# Altium schematic sheet power.SchDoc: Power
size A; Engineer: A. Peck; Organization: UCLA High Energy Physics; DocumentNumber: 14; Revision: 3.0; SheetNumber: 14; SheetTotal: 15; Project: LCT Comparator Tester
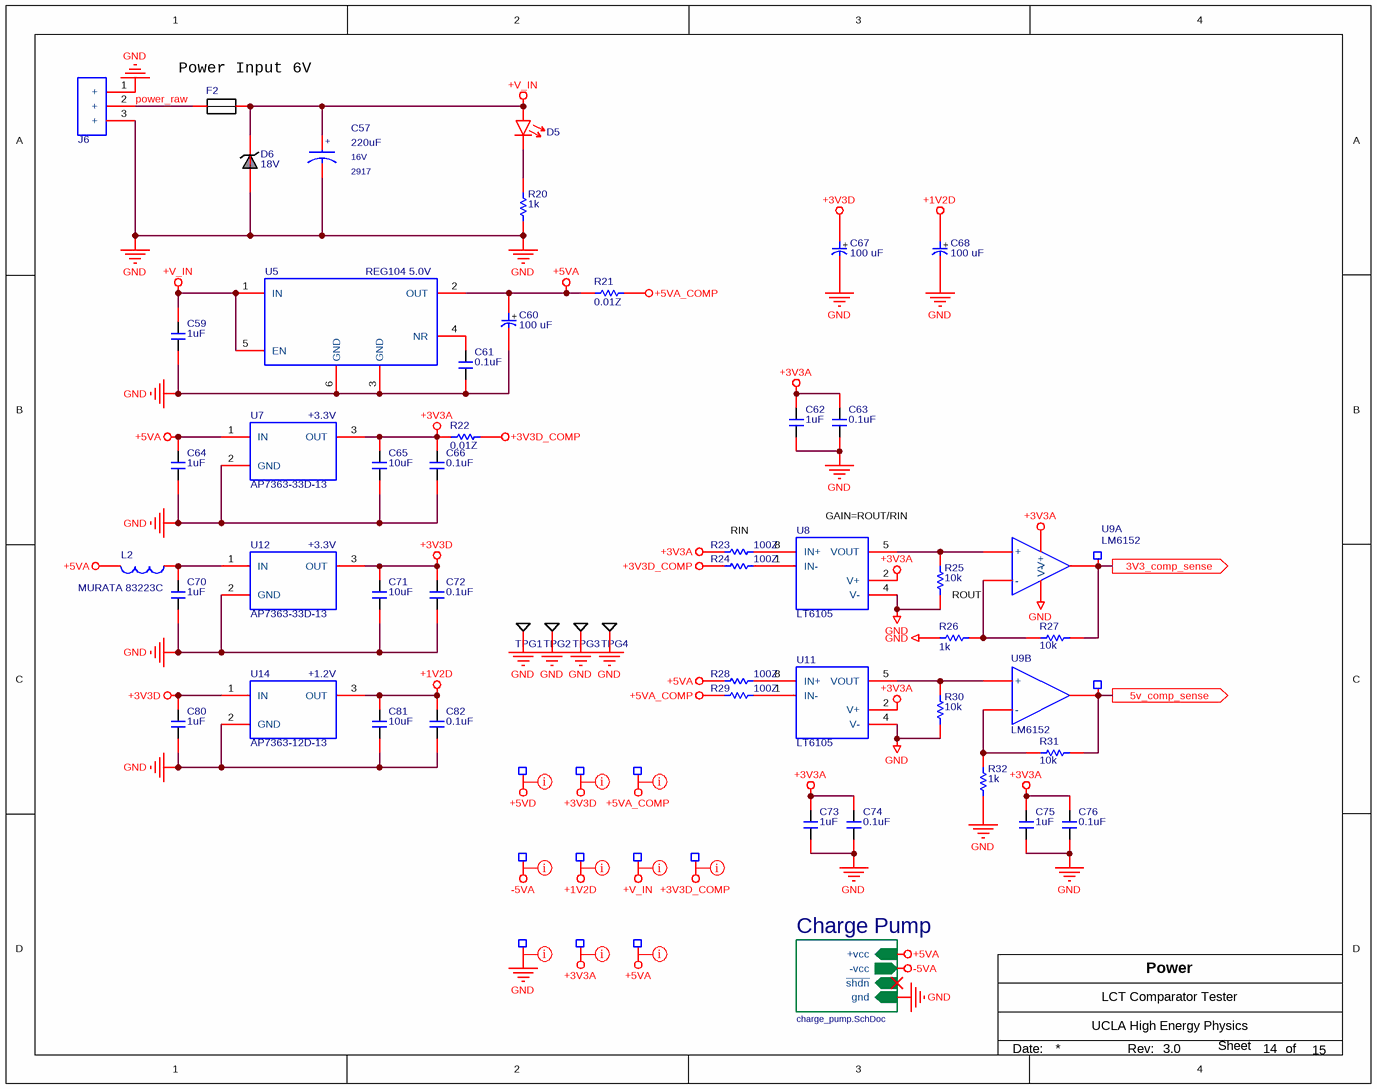
[diagram p0: power.SchDoc]

## Parts
C57  220uF  Voltage - Rated: 16V  package: 2917  [C2917_POLAR]
C59  1uF  [C0603]
C60  100 uF  [C2917_POLAR]
C61  0.1uF  [C0603]
C62  1uF  [C0603]
C63  0.1uF  [C0603]
C64  1uF  [C0603]
C65  10uF  [c1206]
C66  0.1uF  [C0603]
C67  100 uF  [C2917_POLAR]
C68  100 uF  [C2917_POLAR]
C70  1uF  [C0603]
C71  10uF  [c1206]
C72  0.1uF  [C0603]
C73  1uF  [C0603]
C74  0.1uF  [C0603]
C75  1uF  [C0603]
C76  0.1uF  [C0603]
C80  1uF  [C0603]
C81  10uF  [c1206]
C82  0.1uF  [C0603]
D5  LITEON/LTST-C171KRKT  [LED0805]  (value not drawn)
D6  18V  [DIODE SMB]
F2  Littelfuse/1206L  [R1206]  (value not drawn)
J6  TE/640456-3  [CON 3X1]  (value not drawn)
L2  MURATA 83223C  [MURATA-8300]
R20  1k  [R0603]
R21  0.01Z  [R1206]
R22  0.01Z  [R1206]
R23  100Z  [R0603]
R24  100Z  [R0603]
R25  10k  [R0603]
R26  1k  [R0603]
R27  10k  [R0603]
R28  100Z  [R0603]
R29  100Z  [R0603]
R30  10k  [R0603]
R31  10k  [R0603]
R32  1k  [R0603]
TP9  i3v3  [TP_MICRO]  (value not drawn)  (no BOM)
TP10  i5v0  [TP_MICRO]  (value not drawn)  (no BOM)
TP11  +5VD  [TP_MICRO]  (value not drawn)  (no BOM)
TP12  +3.3VD  [TP_MICRO]  (value not drawn)  (no BOM)
TP13  +5V COMP  [TP_MICRO]  (value not drawn)  (no BOM)
TP15  -5V  [TP_MICRO]  (value not drawn)  (no BOM)
TP16  +1.2V  [TP_MICRO]  (value not drawn)  (no BOM)
TP17  Power  [TP_MICRO]  (value not drawn)  (no BOM)
TP18  +3.3V COMP  [TP_MICRO]  (value not drawn)  (no BOM)
TP19  +3.3VA  [TP_MICRO]  (value not drawn)  (no BOM)
TP20  +5VA  [TP_MICRO]  (value not drawn)  (no BOM)
TP21  GND  [TP_MICRO]  (value not drawn)  (no BOM)
TPG1  TPG  [TPG]  (value not drawn)  (no BOM)
TPG2  TPG  [TPG]  (value not drawn)  (no BOM)
TPG3  TPG  [TPG]  (value not drawn)  (no BOM)
TPG4  TPG  [TPG]  (value not drawn)  (no BOM)
U5  REG104 5.0V  [SOT223-6]
U7  AP7363-33D-13  [TO252-2(3)]
U8  LT6105  [MSOP-8]
U9  LM6152  [SOIC-8]  (parts A,B of 2)
U11  LT6105  [MSOP-8]
U12  AP7363-33D-13  [TO252-2(3)]
U14  AP7363-12D-13  [TO252-2(3)]

## Sub-sheets
Charge Pump = charge_pump.SchDoc: ~{shdn} (in), gnd (in), -vcc (out), +vcc (in)

## Ports
3V3_comp_sense (out), 5v_comp_sense (out)

## Nets
+1V2D: C68.1(+) C81.2 C82.1 TP16.1 U14.3(OUT)
+3V3A: C62.2 C63.2 C65.2 C66.1 C73.2 C74.2 C75.2 C76.2 R22.1 R23.1 TP19.1 U7.3(OUT) U8.2(V+) U9.8(V+) U11.2(V+)
+3V3D: C67.1(+) C71.2 C72.1 C80.1 TP12.1 U12.3(OUT) U14.1(IN)
+3V3D_COMP: R22.2 R24.1 TP18.1
+5VA: C60.1(+) C64.1 L2.1 R21.1 R28.1 TP20.1 U5.2(OUT) U7.1(IN) ; sheet Charge Pump/+vcc
+5VA_COMP: R21.2 R29.1 TP13.1
+5VD: TP11.1
+V_IN: C57.1 C59.1 D5.A D6.K F2.2 TP17.1 U5.1(IN) U5.5(EN)
-5VA: TP15.1 ; sheet Charge Pump/-vcc
GND: C57.2 C59.2 C60.2(-) C61.2 C62.1 C63.1 C64.2 C65.1 C66.2 C67.2(-) C68.2(-) C70.2 C71.1 C72.2 C73.1 C74.1 C75.1 C76.1 C80.2 C81.1 C82.2 D6.A J6.1(+) J6.3(+) R20.1 R25.1 R26.1 R30.1 R32.1 TP21.1 TPG1.1 TPG2.1 TPG3.1 TPG4.1 U5.3(GND) U5.6(GND) U7.2(GND) U8.4(V-) U9.4(V-) U11.4(V-) U12.2(GND) U14.2(GND) ; sheet Charge Pump/gnd
3V3_comp_sense: R27.1 TP9.1 U9.1(OUTA) ; port 3V3_comp_sense
5v_comp_sense: R31.1 TP10.1 U9.7(OUTB) ; port 5v_comp_sense
power_raw: F2.1 J6.2(+)
NetC61_1: C61.1 U5.4(NR)
NetC70_1: C70.1 L2.2 U12.1(IN)
NetD5_C: D5.C R20.2
NetR23_2: R23.2 U8.8(IN+)
NetR24_2: R24.2 U8.1(IN-)
NetR25_2: R25.2 U8.5(VOUT) U9.3(+)
NetR26_2: R26.2 R27.2 U9.2(-)
NetR28_2: R28.2 U11.8(IN+)
NetR29_2: R29.2 U11.1(IN-)
NetR30_2: R30.2 U9.5(+) U11.5(VOUT)
NetR31_2: R31.2 R32.2 U9.6(-)

Not connected (* = marked no-connect by the designer): U8 3(NC) 6(NC) 7(NC); U11 3(NC) 6(NC) 7(NC)

## Layout directives
net class Power: +1V2D, +3V3A, +3V3D, +3V3D_COMP, +5VA, +5VA_COMP, +5VD, +V_IN, -5VA
net class Ground: GND

## Notes on the sheet
- (near F2) Power Input 6V
- (near R23) RIN
- (near U8) GAIN=ROUT/RIN
- (near R25) ROUT
- Date:
- Rev:
- of
- Sheet
- (in symbol Diodes/AP7363-12D-13) +1.2V
- (in symbol Diodes/AP7363-33D-13) +3.3V
- (in symbol T491D227K016AT) +

## Library data of the parts
C57 = T491D227K016AT: CAP-TANT, 2, 220UF 16V 10% 2917; Manufacturer: KEMET; Manufacturer Size Code: D; Capacitance: 220µF; ESR (Equivalent Series Resistance): 500 mOhm; Lifetime @ Temp.: 2000 Hrs @ 85°C; Type: Molded; Supplier 1: Digi-Key; Manufacturer Part Number: T491D227K016AT; RoHS: RoHS Compliant; Category: Capacitors; Stock 1: 48724; Pricing 1: 1=1.28, 10=1.009, 25=0.9248, 50=0.8744, 100=0.7568, 250=0.67268 (USD); Packaging: Cut Tape (CT); Tolerance: ±10%; Operating Temperature: -55°C ~ 125°C; Lead Spacing: -; Size / Dimension: 0.287" L x 0.169" W (7.30mm x 4.30mm); Height - Seated (Max): 0.122" (3.10mm); Mounting Type: Surface Mount; Package / Case: 2917 (7343 Metric); ComponentLink1URL: http://www.kemet.com/Lists/ProductCatalog/Attachments/254/KEM_T2005_T491.pdf; ComponentLink1Description: http://www.kemet.com/Lists/ProductCatalog/Attachments/254/KEM_T2005_T491.pdf; Supplier Part Number 1: 399-10429-1-ND; Part Status: Active; Features: General Purpose; Failure Rate: -; Supplier 2: Digi-Key; Stock 2: 48724; Pricing 2: 1=1.28, 10=1.009, 25=0.9248, 50=0.8744, 100=0.7568, 250=0.67268 (USD); Supplier Part Number 2: 399-10429-6-ND
C59 C62 C64 C70 C73 C75 C80 = Murata/GRM188R61E105KA12D: CAP-CER, 2, 1.0uF, 10%, 25V, 0603; Manufacturer: Murata Electronics North America; Capacitance: 1µF; Temperature Coefficient: X5R; Supplier 1: Digi-Key; Manufacturer Part Number: GRM188R61E105KA12D; RoHS: RoHS Compliant; Category: Capacitors; Packaging: Cut Tape (CT); Tolerance: ±10%; Voltage - Rated: 25V; Mounting Type: Surface Mount, MLCC; Operating Temperature: -55°C ~ 85°C; Package / Case: 0603 (1608 Metric); Size / Dimension: 0.063" L x 0.031" W (1.60mm x 0.80mm); Height - Seated (Max): -; Lead Spacing: -; Features: -; ComponentLink1URL: http://www.murata.com/~/media/webrenewal/support/library/catalog/products/capacitor/mlcc/c02e.pdf; ComponentLink1Description: http://www.murata.com/~/media/webrenewal/support/library/catalog/products/capacitor/mlcc/c02e.pdf; Supplier Part Number 1: 490-3897-1-ND; Stock 1: 1899119; Pricing 1: 1=0.1, 10=0.036, 50=0.0196, 100=0.0165, 250=0.01352, 500=0.01156, 1000=0.009 (USD); Applications: General Purpose; Ratings: -; Thickness (Max): 0.035" (0.90mm); Lead Style: -
C60 C67 C68 = CAP/TAJE107K016R: CAP-TANT, 2, 100uF, 10%, 16V, 2917; Manufacturer: AVX Corporation; Manufacturer Part Number: TAJE107K016RNJ; Manufacturer Size Code: E; Capacitance: 100µF; ESR (Equivalent Series Resistance): 900 mOhm; Type: Molded; Supplier 1: Digi-Key; RoHS: RoHS Compliant; Category: Capacitors; Stock 1: 186; Pricing 1: 1=1.95, 10=1.595, 100=1.1281 (USD); Packaging: Cut Tape (CT); Tolerance: ±10%; Voltage - Rated: 16V; Operating Temperature: -55°C ~ 125°C; Mounting Type: Surface Mount; Package / Case: 2917 (7343 Metric); Size / Dimension: 0.287" L x 0.169" W (7.30mm x 4.30mm); Height - Seated (Max): 0.169" (4.30mm); Lead Spacing: -; Features: General Purpose; Lifetime @ Temp.: -; ComponentLink1URL: http://datasheets.avx.com/TAJ.pdf; ComponentLink1Description: http://datasheets.avx.com/TAJ.pdf; Supplier 2: Newark; Supplier Part Number 1: 478-3945-1-ND; Supplier Part Number 2: 60R6026
C61 C63 C66 C72 C74 C76 C82 = CAP/06035C104KAT2A: CAP-CER, 2, 0.1uF, 10%, 50V, 0603, X7R; Manufacturer: AVX Corporation; Capacitance: 0.10µF; Supplier 1: Digi-Key; Manufacturer Part Number: 06035C104KAT2A; RoHS: RoHS Compliant; Category: Capacitors; Packaging: Cut Tape (CT); Tolerance: ±10%; Voltage - Rated: 50V; Operating Temperature: -55°C ~ 125°C; Mounting Type: Surface Mount, MLCC; Package / Case: 0603 (1608 Metric); Size / Dimension: 0.063" L x 0.032" W (1.60mm x 0.81mm); Height - Seated (Max): -; Lead Spacing: -; Features: -; ComponentLink1URL: http://datasheets.avx.com/X7RDielectric.pdf; ComponentLink1Description: http://datasheets.avx.com/X7RDielectric.pdf; Supplier Part Number 1: 478-5052-1-ND; Stock 1: 4412408; Pricing 1: 1=0.1, 10=0.036, 25=0.0264, 50=0.0198, 100=0.0162, 250=0.01352, 500=0.01156, 1000=0.00908 (USD); Temperature Coefficient: X7R; Applications: General Purpose; Ratings: -; Thickness (Max): 0.035" (0.90mm); Lead Style: -; Supplier 2: Newark; Supplier Part Number 2: 54K2412
C65 C71 C81 = CAP/GMK316F106ZL-T: CAP-CER, 2, 10uF, 10%, 35V, 1206; Manufacturer: Taiyo Yuden; Capacitance: 10µF; Tolerance: -20%, +80%; Temperature Coefficient: Y5V (F); Supplier 1: Digi-Key; Manufacturer Part Number: GMK316F106ZL-T; RoHS: RoHS Compliant; Category: Capacitors; Stock 1: 249989; Pricing 1: 1=0.46, 10=0.345, 50=0.2012, 100=0.161, 250=0.115, 500=0.0782, 1000=0.06325 (USD); Packaging: Cut Tape (CT); Voltage - Rated: 35V; Mounting Type: Surface Mount, MLCC; Operating Temperature: -30°C ~ 85°C; Applications: General Purpose; Ratings: -; Package / Case: 1206 (3216 Metric); Size / Dimension: 0.126" L x 0.063" W (3.20mm x 1.60mm); Height - Seated (Max): -; Thickness (Max): 0.071" (1.80mm); Lead Spacing: -; Features: -; Lead Style: -; ComponentLink1URL: http://ds.yuden.co.jp/TYCOMPAS/ut/detail.do?productNo=GMK316F106ZL-T&fileName=GMK316F106ZL-T_SS&mode=specSheetDownload; ComponentLink1Description: http://ds.yuden.co.jp/TYCOMPAS/ut/detail.do?productNo=GMK316F106ZL-T&fileName=GMK316F106ZL-T_SS&mode=specSheetDownload; Supplier Part Number 1: 587-1352-1-ND
D5 = LITEON/LTST-C171KRKT: LED, 20mA, 0805, Red; Supplier 1: Digi-Key; Supplier Part Number 1: 160-1427-1-ND
D6 = ONSEMI/1SMB5931BT3G: Diode, Zener, 18V, 3W, SMB; Manufacturer: ON Semiconductor; Tolerance: ±5%; Impedance (Max) (Zzt): 12 Ohm; Current - Reverse Leakage @ Vr: 1µA @ 13.7V; Voltage - Forward (Vf) (Max) @ If: 1.5V @ 200mA; Supplier 1: Digi-Key; Manufacturer Part Number: 1SMB5931BT3G; RoHS: RoHS Compliant; Category: Discrete Semiconductor Products; Stock 1: 25092; Pricing 1: 1=0.47, 10=0.35, 100=0.2183, 500=0.14928, 1000=0.11474 (USD); Packaging: Cut Tape (CT); Voltage - Zener (Nom) (Vz): 18V; Power - Max: 3W; Operating Temperature: -65°C ~ 150°C; Mounting Type: Surface Mount; Package / Case: DO-214AA, SMB; Supplier Device Package: SMB; ComponentLink1URL: http://www.onsemi.com/pub_link/Collateral/1SMB5913BT3-D.PDF; ComponentLink1Description: http://www.onsemi.com/pub_link/Collateral/1SMB5913BT3-D.PDF; Supplier Part Number 1: 1SMB5931BT3GOSCT-ND; Part Status: Active; Supplier 2: Newark; Supplier Part Number 2: 45J2455
F2 = Littelfuse/1206L: FUSE, Resetable, 1206 Generic
J6 = TE/640456-3: HEADER, Friction Lock, 3x1; Manufacturer: TE Connectivity AMP Connectors; Connector Type: Header, Unshrouded; Number of Positions: 3; Number of Positions Loaded: All; Pitch: 0.100" (2.54mm); Supplier 1: Digi-Key; Manufacturer Part Number: 640456-3; RoHS: RoHS Compliant; Category: Connectors, Interconnects; Stock 1: 39841; Pricing 1: 1=0.13, 10=0.119, 100=0.095, 500=0.088, 1000=0.081, 2000=0.075, 5000=0.07, 10000=0.056, 25000=0.052 (USD); Packaging: Bulk; Contact Type: Male Pin; Number of Rows: 1; Row Spacing: -; Contact Mating Length: 0.295" (7.49mm); Mounting Type: Through Hole; Termination: Solder; Fastening Type: Friction Lock; Features: -; Contact Finish: Tin; Contact Finish Thickness: -; Color: Natural; ComponentLink1URL: http://www.te.com/commerce/DocumentDelivery/DDEController?Action=srchrtrv&DocNm=640456&DocType=Customer+Drawing&DocLang=English; ComponentLink1Description: http://www.te.com/commerce/DocumentDelivery/DDEController?Action=srchrtrv&DocNm=640456&DocType=Customer+Drawing&DocLang=English; Supplier Part Number 1: A19470-ND
L2 = MURATA 83223C: IND, 22uH, 500mA; Supplier 1: Newark; Supplier Part Number 1: 59T0308
R20 R26 R32 = CRCW06031K00FKEA: RES1, SMD, 1.00k, 1.0%, 1/10W, 0603; Manufacturer: Vishay Dale; Tolerance: ±1%; Power (Watts): 0.1W, 1/10W; Temperature Coefficient: ±100ppm/°C; Supplier 1: Digi-Key; Manufacturer Part Number: CRCW06031K00FKEA; RoHS: RoHS Compliant; Category: Resistors; Stock 1: 770011; Pricing 1: 1=0.1, 10=0.03, 25=0.022, 50=0.0168, 100=0.0123, 250=0.0094, 500=0.00752, 1000=0.00554, 2500=0.00481 (USD); Packaging: Cut Tape (CT); Resistance (Ohms): 1k; Composition: Thick Film; Features: Automotive AEC-Q200; Operating Temperature: -55°C ~ 155°C; Package / Case: 0603 (1608 Metric); Supplier Device Package: 0603; Size / Dimension: 0.061" L x 0.033" W (1.55mm x 0.85mm); Height: 0.020" (0.50mm); Number of Terminations: 2; ComponentLink1URL: http://www.vishay.com/docs/20035/dcrcwe3.pdf; ComponentLink1Description: http://www.vishay.com/docs/20035/dcrcwe3.pdf; Supplier 2: Newark; Supplier Part Number 1: 541-1.00KHCT-ND; Supplier Part Number 2: 52K8015
R21 R22 = RES SMD 0.01 OHM 1% 1W 1206: RES0, SMD, 0.01Z, 1.0%, 1/4W,  1206; Manufacturer: Panasonic Electronic Components; Manufacturer Part Number: ERJ-8BWFR010V; Resistance (Ohms): 0.01; Tolerance: ±1%; Power (Watts): 1W; Temperature Coefficient: ±200ppm/°C; Supplier 1: Digi-Key; RoHS: RoHS Compliant; Category: Resistors; Stock 1: 27187; Pricing 1: 1=0.72, 50=0.464, 100=0.4038, 250=0.36084, 500=0.2921, 1000=0.23625 (USD); Packaging: Cut Tape (CT); Part Status: Active; Composition: Thick Film; Features: Automotive AEC-Q200, Current Sense; Operating Temperature: -55°C ~ 155°C; Package / Case: 1206 (3216 Metric); Supplier Device Package: 1206; Size / Dimension: 0.126" L x 0.063" W (3.20mm x 1.60mm); Height - Seated (Max): 0.030" (0.75mm); Number of Terminations: 2; Failure Rate: -; ComponentLink1URL: https://industrial.panasonic.com/cdbs/www-data/pdf/RDA0000/AOA0000C239.pdf; ComponentLink1Description: https://industrial.panasonic.com/cdbs/www-data/pdf/RDA0000/AOA0000C239.pdf; Supplier Part Number 1: P.010AUCT-ND
R23 R24 R28 R29 = CRCW0603110RFKEA: RES0, SMD,  100Z, 1.0%, 1/10W, 0603; Manufacturer: Panasonic Electronic Components; Manufacturer Part Number: ERJ-3EKF1000V; Resistance (Ohms): 100; Tolerance: ±1%; Power (Watts): 0.1W, 1/10W; Temperature Coefficient: ±100ppm/°C; RoHS: RoHS Compliant; Category: Resistors; Packaging: Cut Tape (CT); Composition: Thick Film; Features: Automotive AEC-Q200; Operating Temperature: -55°C ~ 155°C; Package / Case: 0603 (1608 Metric); Supplier Device Package: 0603; Size / Dimension: 0.063" L x 0.031" W (1.60mm x 0.80mm); Height: 0.022" (0.55mm); Number of Terminations: 2; ComponentLink1URL: http://industrial.panasonic.com/www-cgi/jvcr13pz.cgi?E+PZ+3+AOA0002+ERJ3EKF1000V+7+WW; ComponentLink1Description: http://industrial.panasonic.com/www-cgi/jvcr13pz.cgi?E+PZ+3+AOA0002+ERJ3EKF1000V+7+WW; Supplier 1: Digi-Key; Stock 1: 1259466; Pricing 1: 1=0.1, 50=0.015, 100=0.0114, 250=0.00844, 500=0.00624, 1000=0.00416, 2500=0.00351 (USD); Supplier Part Number 1: P100HCT-ND
R25 R27 R30 R31 = CRCW060310K0FKEA: RES1, SMD, 10.0k, 1.0%, 1/10W, 0603; Manufacturer: Vishay Dale; Tolerance: ±1%; Power (Watts): 0.1W, 1/10W; Temperature Coefficient: ±100ppm/°C; Supplier 1: Digi-Key; Manufacturer Part Number: CRCW060310K0FKEA; RoHS: RoHS Compliant; Category: Resistors; Stock 1: 1592879; Pricing 1: 1=0.1, 10=0.03, 25=0.022, 50=0.0168, 100=0.0123, 250=0.0094, 500=0.00752, 1000=0.00554, 2500=0.00481 (USD); Packaging: Cut Tape (CT); Resistance (Ohms): 10k; Composition: Thick Film; Features: Automotive AEC-Q200; Operating Temperature: -55°C ~ 155°C; Package / Case: 0603 (1608 Metric); Supplier Device Package: 0603; Size / Dimension: 0.061" L x 0.033" W (1.55mm x 0.85mm); Height: 0.020" (0.50mm); Number of Terminations: 2; ComponentLink1URL: http://www.vishay.com/docs/20035/dcrcwe3.pdf; ComponentLink1Description: http://www.vishay.com/docs/20035/dcrcwe3.pdf; Supplier Part Number 1: 541-10.0KHCT-ND
TP9-TP13 TP15-TP21 = TP_MICRO: Test Point, Round, Small
TPG1-TPG4 = TPG: Test Point, GND, Through Hole
U5 = TI/REG104 5V0 SOT223-6: LDO, 5.0V Fixed, 1A, DMOS; Manufacturer: Texas Instruments; Manufacturer Part Number: REG104GA-5/2K5; Regulator Topology: Positive Fixed; Voltage - Output: 5V; Voltage - Dropout (Typical): 0.32V @ 1A; Number of Regulators: 1; Voltage - Input: Up to 15V; Current - Limit (Min): 1.2A; Supplier 1: Digi-Key; RoHS: RoHS Compliant; Category: Integrated Circuits (ICs); Stock 1: 30; Pricing 1: 1=5.41, 10=4.851, 100=3.9798, 500=3.3858, 1000=2.8512 (USD); Packaging: Cut Tape (CT); Current - Output: 1A; Operating Temperature: -40°C ~ 85°C; Mounting Type: Surface Mount; Package / Case: SOT-223-6; Supplier Device Package: SOT-223-6; ComponentLink1URL: http://www.ti.com/lit/ds/symlink/reg104.pdf; ComponentLink1Description: http://www.ti.com/lit/ds/symlink/reg104.pdf; Supplier Part Number 1: REG104GA-5CT-ND
U7 U12 = Diodes/AP7363-33D-13: LDO, 3.3V, 1.5A, 190mV Dropout, Ceramic Stable, +5.5VMAX Input; Supplier 1: Digi-Key; Supplier Part Number 1: AP7363-33D-13CT-ND
U8 U11 = LT/LT6105CMS8#PBF: OPA, Current Sense, 100 kHz, Extended Input Range; Manufacturer: Linear Technology; Number of Circuits: 1; Slew Rate: 2 V/µs; -3db Bandwidth: 100kHz; Voltage - Input Offset: 100µV; Current - Supply: 240µA; Current - Output / Channel: 1mA; Voltage - Supply, Single/Dual (±): 2.85 V ~ 36 V, ±1.425 V ~ 18 V; Supplier 1: Digi-Key; Manufacturer Part Number: LT6105CMS8#PBF; RoHS: RoHS Compliant; Category: Integrated Circuits (ICs); Stock 1: 2594; Pricing 1: 1=2.11, 25=1.4012, 100=1.15 (USD); Packaging: Tube; Amplifier Type: Current Sense; Output Type: -; Gain Bandwidth Product: -; Current - Input Bias: -; Operating Temperature: 0°C ~ 70°C; Mounting Type: Surface Mount; Package / Case: 8-TSSOP, 8-MSOP (0.118", 3.00mm Width); Supplier Device Package: 8-MSOP; ComponentLink1URL: http://www.linear.com/docs/25764; ComponentLink1Description: http://www.linear.com/docs/25764; Supplier 2: Newark; Supplier Part Number 1: LT6105CMS8#PBF-ND; Supplier Part Number 2: 75M4760
U9 = TI/LM6152 SOIC-8: OPA- 75MHz, Dual, RRIO, Single-supply; Manufacturer: Texas Instruments; Manufacturer Part Number: LM6152BCMX/NOPB; Amplifier Type: General Purpose; Number of Circuits: 2; Output Type: Rail-to-Rail; Slew Rate: 30 V/µs; Gain Bandwidth Product: 80MHz; Current - Input Bias: 500nA; Voltage - Input Offset: 300µV; Current - Supply: 1.6mA; Current - Output / Channel: 16.9mA; Voltage - Supply, Single/Dual (±): 2.7 V ~ 24 V, ±1.35 V ~ 12 V; Supplier 1: Digi-Key; RoHS: RoHS Compliant; Category: Integrated Circuits (ICs); Stock 1: 6943; Pricing 1: 1=3.66, 10=3.285, 100=2.6954, 500=2.29312, 1000=1.67625 (USD); Packaging: Cut Tape (CT); Part Status: Active; -3db Bandwidth: -; Operating Temperature: 0°C ~ 70°C; Mounting Type: Surface Mount; Package / Case: 8-SOIC (0.154", 3.90mm Width); Supplier Device Package: 8-SOIC; ComponentLink1URL: http://www.ti.com/lit/ds/symlink/lm6152.pdf; ComponentLink1Description: http://www.ti.com/lit/ds/symlink/lm6152.pdf; Supplier Part Number 1: 296-35423-1-ND
U14 = Diodes/AP7363-12D-13: LDO, 1.2V, 1.5A, 190mV Dropout, Ceramic Stable, +5.5VMAX Input; Manufacturer: Diodes Incorporated; Regulator Topology: Positive Fixed; Number of Regulators: 1; Voltage - Input: 2.2 V ~ 5.5 V; Supplier 1: Digi-Key; Manufacturer Part Number: AP7363-12D-13; RoHS: RoHS Compliant; Category: Integrated Circuits (ICs); Stock 1: 5601; Pricing 1: 1=0.56, 10=0.484, 100=0.3613, 500=0.28376, 1000=0.21875 (USD); Packaging: Cut Tape (CT); Voltage - Output: 1.2V; Current - Output: 1.5A; Voltage - Dropout (Typical): -; Current - Limit (Min): -; Operating Temperature: -40°C ~ 85°C; Mounting Type: Surface Mount; Package / Case: TO-252-3, DPak (2 Leads + Tab), SC-63; Supplier Device Package: TO-252-3; ComponentLink1URL: http://www.diodes.com/_files/datasheets/AP7363.pdf; ComponentLink1Description: http://www.diodes.com/_files/datasheets/AP7363.pdf; Supplier Part Number 1: AP7363-12D-13CT-ND; Part Status: Active